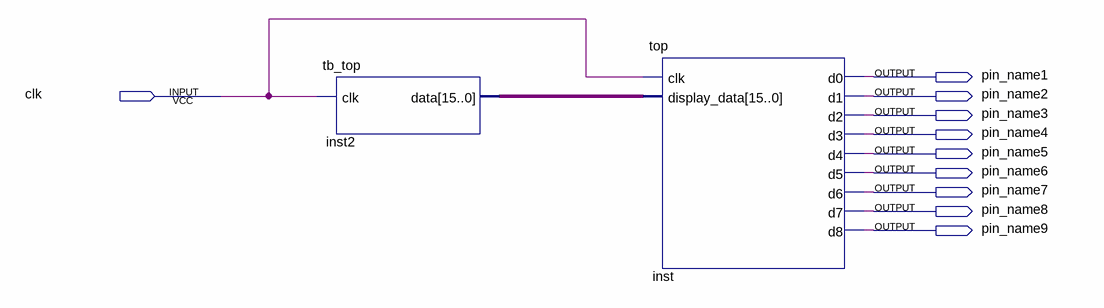
[diagram p0: schematic sheet]
// Quartus schematic oneByteDisplay.bdf as structural Verilog: 2 symbols, 10 pins
module oneByteDisplay (
  input  clk,
  output pin_name1,
  output pin_name2,
  output pin_name3,
  output pin_name4,
  output pin_name5,
  output pin_name6,
  output pin_name7,
  output pin_name8,
  output pin_name9
);

  wire [15:0] inst2_data;

  tb_top inst2 (.clk(clk), .data(inst2_data));
  top inst (
    .clk(clk), .display_data(inst2_data), .d0(pin_name1), .d1(pin_name2), .d2(pin_name3), .d3(pin_name4),
    .d4(pin_name5), .d5(pin_name6), .d6(pin_name7), .d7(pin_name8), .d8(pin_name9));
endmodule
